# EAGLE schematic sensors_b (EAGLE 9.6.2)
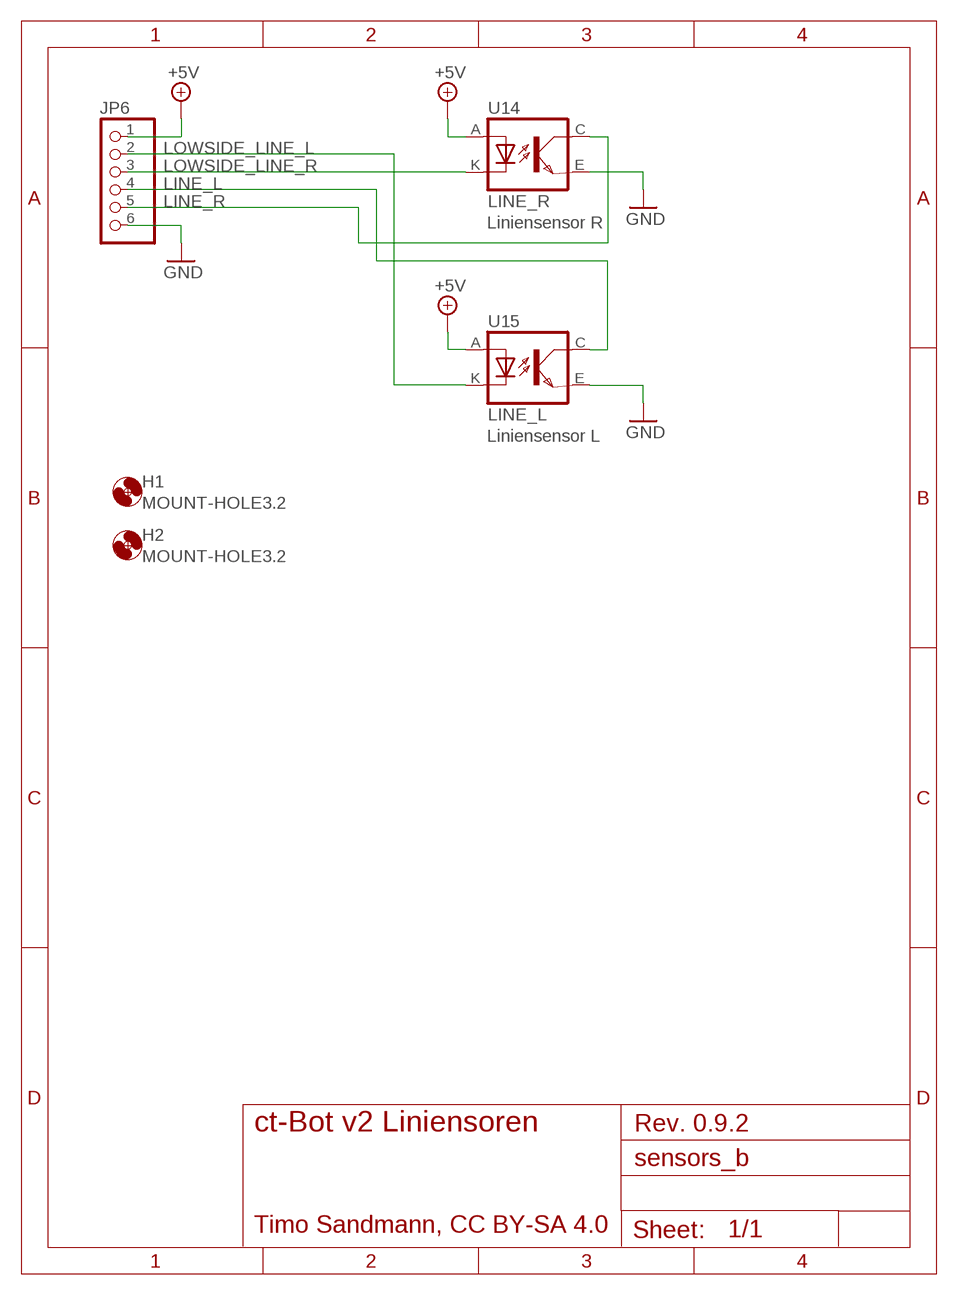
[diagram p0: schematic, sheet 1]

## Parts
H1  MOUNT-HOLE3.2  [3,2]
H2  MOUNT-HOLE3.2  [3,2]
JP6  PINHD-1X6  [1X06]
U14  LINE_R  CNY70DEF  [4]
U15  LINE_L  CNY70DEF  [4]

## Nets
+5V: JP6.1 U14.A U15.A
GND: JP6.6 U14.E(EMI) U15.E(EMI)
LINE_L: JP6.4 U15.C(COL)
LINE_R: JP6.5 U14.C(COL)
LOWSIDE_LINE_L: JP6.2 U15.K(C)
LOWSIDE_LINE_R: JP6.3 U14.K(C)

## Notes on the sheet
- Liniensensor R
- Liniensensor L
- Rev. 0.9.2
- ct-Bot v2 Liniensoren
- Timo Sandmann, CC BY-SA 4.0

## Library data of the parts
H1 H2 = myholes:MOUNT-HOLE: MOUNTING HOLE with drill center marker
JP6 = ct-bot:PINHD-1X6: PIN HEADER
U14 U15 = ct-bot:CNY70